# Altium schematic sheet TOP.SchDoc: TOP
size A4; Author: Silvio Navaretti; CompanyName: Arduino SRL; DrawnBy: Silvio Navaretti; Engineer: Silvio Navaretti; Organization: Arduino SRL; DocumentNumber: ASX00083; SheetNumber: 1; SheetTotal: 11; RevAuthor: Silvio Navaretti
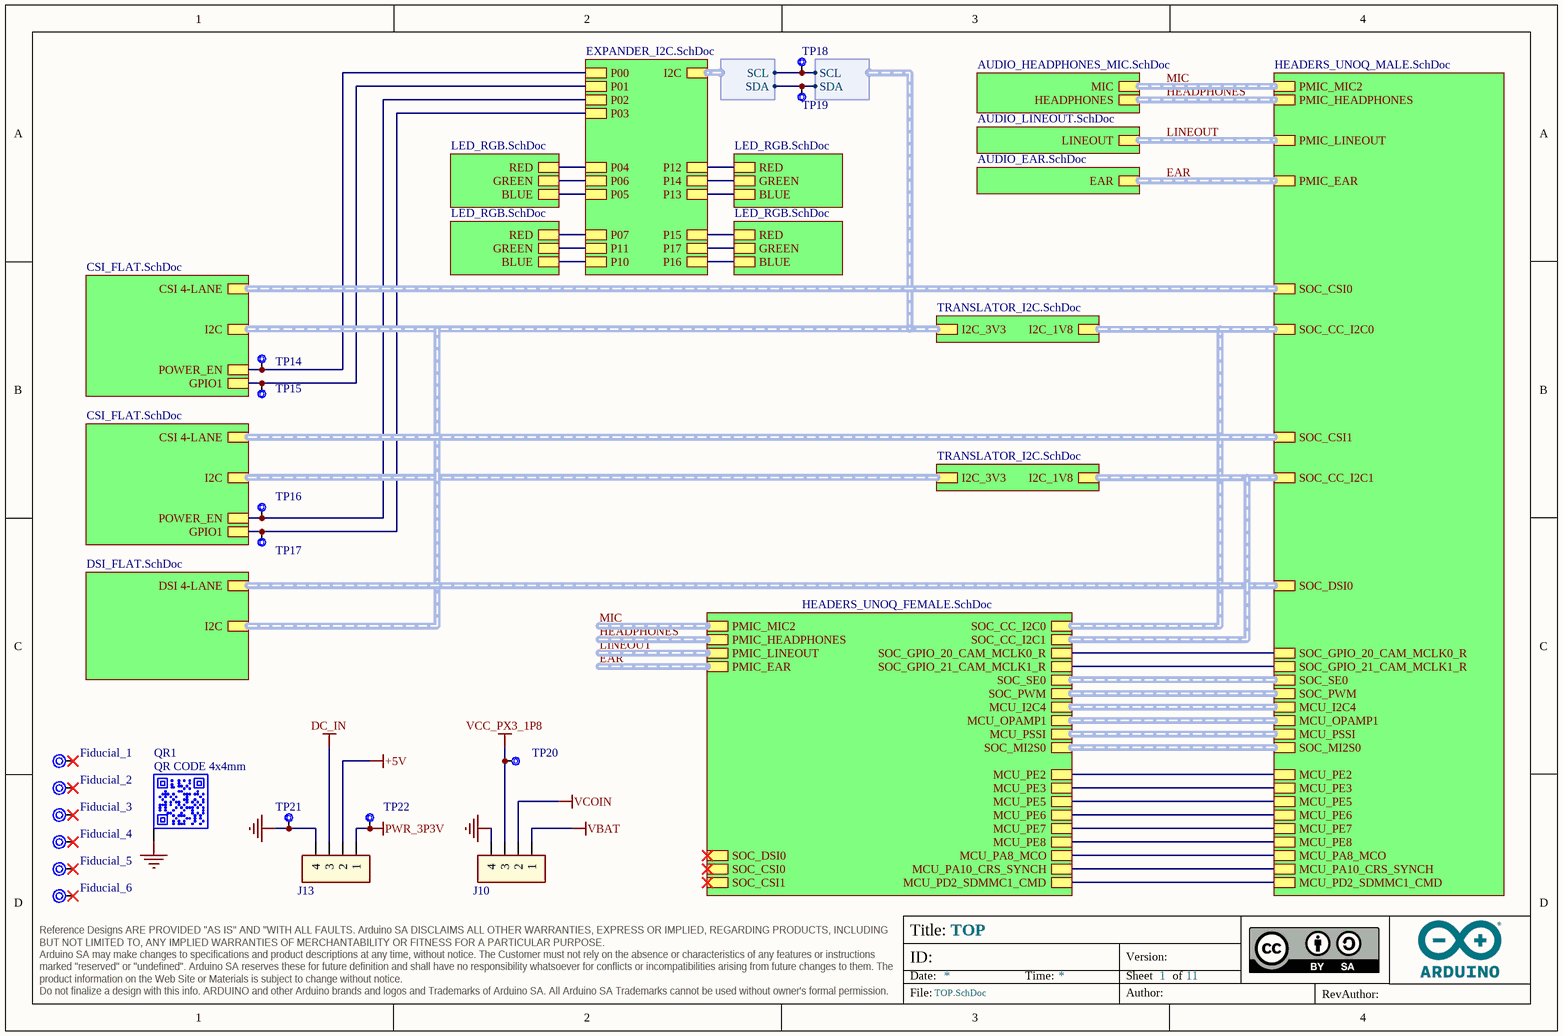
[diagram p0: TOP.SchDoc]

## Parts
Fiducial_1  Fiducial mark 1mm with 2mm solder  [Fiducial mark 1mm with circle-Footprint-1]  (value not drawn)  (no BOM)
Fiducial_2  Fiducial mark 1mm with 2mm solder  [Fiducial mark 1mm with circle-Footprint-1]  (value not drawn)  (no BOM)
Fiducial_3  Fiducial mark 1mm with 2mm solder  [Fiducial mark 1mm with circle-Footprint-1]  (value not drawn)  (no BOM)
Fiducial_4  Fiducial mark 1mm with 2mm solder  [Fiducial mark 1mm with circle-Footprint-1]  (value not drawn)  (no BOM)
Fiducial_5  Fiducial mark 1mm with 2mm solder  [Fiducial mark 1mm with circle-Footprint-1]  (value not drawn)  (no BOM)
Fiducial_6  Fiducial mark 1mm with 2mm solder  [Fiducial mark 1mm with circle-Footprint-1]  (value not drawn)  (no BOM)
J10  HEADER TH 2.54mm VERT. 1x004POS  [PIN HEADER 2.54mm VERT. 1x4POS-Footprint-1]  (value not drawn)  (no BOM)
J13  HEADER TH 2.54mm VERT. 1x004POS  [PIN HEADER 2.54mm VERT. 1x4POS-Footprint-1]  (value not drawn)  (no BOM)
QR1  QR CODE 4x4mm  [QR CODE 4x4mm]  (no BOM)
TP14  Test point 1.00mm  [TP-1.00MM]  (value not drawn)  (no BOM)
TP15  Test point 1.00mm  [TP-1.00MM]  (value not drawn)  (no BOM)
TP16  Test point 1.00mm  [TP-1.00MM]  (value not drawn)  (no BOM)
TP17  Test point 1.00mm  [TP-1.00MM]  (value not drawn)  (no BOM)
TP18  Test point 1.00mm  [TP-1.00MM]  (value not drawn)  (no BOM)
TP19  Test point 1.00mm  [TP-1.00MM]  (value not drawn)  (no BOM)
TP20  Test point 1.00mm  [TP-1.00MM]  (value not drawn)  (no BOM)
TP21  Test point 1.00mm  [TP-1.00MM]  (value not drawn)  (no BOM)
TP22  Test point 1.00mm  [TP-1.00MM]  (value not drawn)  (no BOM)

## Sub-sheets
U_AUDIO_EAR = AUDIO_EAR.SchDoc: EAR (harness EAR)
U_AUDIO_HEADPHONES_MIC = AUDIO_HEADPHONES_MIC.SchDoc: MIC (harness MIC), HEADPHONES (harness HEADPHONES)
U_AUDIO_LINEOUT = AUDIO_LINEOUT.SchDoc: LINEOUT (harness LINEOUT)
U_DSI_FLAT = DSI_FLAT.SchDoc: I2C (harness I2C), DSI 4-LANE (harness SOC_GPIO)
U_FLAT_CSI = CSI_FLAT.SchDoc: I2C (harness I2C), CSI 4-LANE (harness IMOLA_CSI), POWER_EN, GPIO1
U_FLAT_CSI = CSI_FLAT.SchDoc: I2C (harness I2C), CSI 4-LANE (harness IMOLA_CSI), POWER_EN, GPIO1
U_HEADERS_IMOLA_FEMALE = HEADERS_UNOQ_FEMALE.SchDoc: SOC_CSI0 (harness IMOLA_CSI), SOC_GPIO_20_CAM_MCLK0_R, SOC_CC_I2C1 (harness I2C), SOC_CSI1 (harness IMOLA_CSI), SOC_GPIO_21_CAM_MCLK1_R, SOC_CC_I2C0 (harness I2C), SOC_DSI0 (harness IMOLA_DSI), MCU_PSSI (harness PSSI_MCU), PMIC_MIC2 (harness MIC), MCU_PD2_SDMMC1_CMD, MCU_I2C4 (harness I2C), MCU_OPAMP1 (harness MCU_OPAMP), PMIC_LINEOUT (harness LINEOUT), PMIC_HEADPHONES (harness HEADPHONES), SOC_PWM (harness SOC_PWM), SOC_SE0 (harness SOC_GPIO), MCU_PA10_CRS_SYNCH, MCU_PA8_MCO, MCU_PE7, MCU_PE8, PMIC_EAR (harness EAT), SOC_MI2S0 (harness SOC_I2S), MCU_PE2, MCU_PE3, MCU_PE5, MCU_PE6
U_HEADERS_IMOLA_MALE = HEADERS_UNOQ_MALE.SchDoc: SOC_CSI0 (harness IMOLA_CSI), SOC_GPIO_20_CAM_MCLK0_R, SOC_CC_I2C1 (harness I2C), SOC_CSI1 (harness IMOLA_CSI), SOC_GPIO_21_CAM_MCLK1_R, SOC_CC_I2C0 (harness I2C), SOC_DSI0 (harness IMOLA_DSI), MCU_PSSI (harness PSSI_MCU), PMIC_MIC2 (harness MIC), MCU_PD2_SDMMC1_CMD, MCU_I2C4 (harness I2C), MCU_OPAMP1 (harness MCU_OPAMP), PMIC_LINEOUT (harness LINEOUT), PMIC_HEADPHONES (harness HEADPHONES), SOC_PWM (harness SOC_PWM), SOC_SE0 (harness SOC_GPIO), MCU_PA10_CRS_SYNCH, MCU_PA8_MCO, MCU_PE7, MCU_PE8, PMIC_EAR (harness EAT), SOC_MI2S0 (harness SOC_I2S), MCU_PE2, MCU_PE3, MCU_PE5, MCU_PE6
U_LED_RGB_1 = LED_RGB.SchDoc: GREEN, BLUE, RED
U_LED_RGB_2 = LED_RGB.SchDoc: GREEN, BLUE, RED
U_LED_RGB_3 = LED_RGB.SchDoc: GREEN, BLUE, RED
U_LED_RGB_4 = LED_RGB.SchDoc: GREEN, BLUE, RED
U_Sheet1 = EXPANDER_I2C.SchDoc: I2C (harness I2C), P00, P01, P02, P03, P04, P05, P06, P07, P10, P11, P12, P13, P14, P15, P16, P17
U_TRANSLATOR_I2C = TRANSLATOR_I2C.SchDoc: I2C_3V3 (harness I2C), I2C_1V8 (harness I2C)
U_TRANSLATOR_I2C = TRANSLATOR_I2C.SchDoc: I2C_3V3 (harness I2C), I2C_1V8 (harness I2C)

## Harnesses
I2C: SDA, SCL

## Nets
+5V: J13.2
DC_IN: J13.3
GND: J10.4 J13.4 QR1.PAD TP21.X
PWR_3P3V: J13.1 TP22.X
VBAT: J10.1
VCC_PX3_1P8: J10.3 TP20.X
VCOIN: J10.2
NetTP14_X: TP14.X ; sheet U_FLAT_CSI/POWER_EN, sheet U_Sheet1/P00
NetTP15_X: TP15.X ; sheet U_FLAT_CSI/GPIO1, sheet U_Sheet1/P01
NetTP16_X: TP16.X ; sheet U_FLAT_CSI/POWER_EN, sheet U_Sheet1/P02
NetTP17_X: TP17.X ; sheet U_FLAT_CSI/GPIO1, sheet U_Sheet1/P03
NetTP18_X: TP18.X ; sheet U_Sheet1/I2C.SCL, sheet U_FLAT_CSI/I2C.SCL
NetTP19_X: TP19.X ; sheet U_Sheet1/I2C.SDA, sheet U_FLAT_CSI/I2C.SDA
(unnamed): sheet U_HEADERS_IMOLA_MALE/SOC_GPIO_20_CAM_MCLK0_R, sheet U_HEADERS_IMOLA_FEMALE/SOC_GPIO_20_CAM_MCLK0_R
(unnamed): sheet U_HEADERS_IMOLA_MALE/SOC_GPIO_21_CAM_MCLK1_R, sheet U_HEADERS_IMOLA_FEMALE/SOC_GPIO_21_CAM_MCLK1_R
(unnamed): sheet U_HEADERS_IMOLA_MALE/MCU_PD2_SDMMC1_CMD, sheet U_HEADERS_IMOLA_FEMALE/MCU_PD2_SDMMC1_CMD
(unnamed): sheet U_HEADERS_IMOLA_MALE/MCU_PA10_CRS_SYNCH, sheet U_HEADERS_IMOLA_FEMALE/MCU_PA10_CRS_SYNCH
(unnamed): sheet U_HEADERS_IMOLA_MALE/MCU_PA8_MCO, sheet U_HEADERS_IMOLA_FEMALE/MCU_PA8_MCO
(unnamed): sheet U_HEADERS_IMOLA_MALE/MCU_PE7, sheet U_HEADERS_IMOLA_FEMALE/MCU_PE7
(unnamed): sheet U_HEADERS_IMOLA_MALE/MCU_PE8, sheet U_HEADERS_IMOLA_FEMALE/MCU_PE8
(unnamed): sheet U_HEADERS_IMOLA_MALE/MCU_PE2, sheet U_HEADERS_IMOLA_FEMALE/MCU_PE2
(unnamed): sheet U_HEADERS_IMOLA_MALE/MCU_PE3, sheet U_HEADERS_IMOLA_FEMALE/MCU_PE3
(unnamed): sheet U_HEADERS_IMOLA_MALE/MCU_PE5, sheet U_HEADERS_IMOLA_FEMALE/MCU_PE5
(unnamed): sheet U_HEADERS_IMOLA_MALE/MCU_PE6, sheet U_HEADERS_IMOLA_FEMALE/MCU_PE6
(unnamed): sheet U_Sheet1/P04, sheet U_LED_RGB_1/RED
(unnamed): sheet U_Sheet1/P05, sheet U_LED_RGB_1/BLUE
(unnamed): sheet U_Sheet1/P06, sheet U_LED_RGB_1/GREEN
(unnamed): sheet U_Sheet1/P07, sheet U_LED_RGB_2/RED
(unnamed): sheet U_Sheet1/P10, sheet U_LED_RGB_2/BLUE
(unnamed): sheet U_Sheet1/P11, sheet U_LED_RGB_2/GREEN
(unnamed): sheet U_Sheet1/P12, sheet U_LED_RGB_3/RED
(unnamed): sheet U_Sheet1/P13, sheet U_LED_RGB_3/BLUE
(unnamed): sheet U_Sheet1/P14, sheet U_LED_RGB_3/GREEN
(unnamed): sheet U_Sheet1/P15, sheet U_LED_RGB_4/RED
(unnamed): sheet U_Sheet1/P16, sheet U_LED_RGB_4/BLUE
(unnamed): sheet U_Sheet1/P17, sheet U_LED_RGB_4/GREEN

Not connected (* = marked no-connect by the designer): Fiducial_1 1*; Fiducial_2 1*; Fiducial_3 1*; Fiducial_4 1*; Fiducial_5 1*; Fiducial_6 1*

## Buses and harness runs
harness EAR = sheet U_AUDIO_EAR/EAR = sheet U_HEADERS_IMOLA_MALE/PMIC_EAR
harness EAR = sheet U_HEADERS_IMOLA_FEMALE/PMIC_EAR
harness HEADPHONES = sheet U_AUDIO_HEADPHONES_MIC/HEADPHONES = sheet U_HEADERS_IMOLA_MALE/PMIC_HEADPHONES
harness HEADPHONES = sheet U_HEADERS_IMOLA_FEMALE/PMIC_HEADPHONES
harness LINEOUT = sheet U_AUDIO_LINEOUT/LINEOUT = sheet U_HEADERS_IMOLA_MALE/PMIC_LINEOUT
harness LINEOUT = sheet U_HEADERS_IMOLA_FEMALE/PMIC_LINEOUT
harness MIC = sheet U_AUDIO_HEADPHONES_MIC/MIC = sheet U_HEADERS_IMOLA_MALE/PMIC_MIC2
harness MIC = sheet U_HEADERS_IMOLA_FEMALE/PMIC_MIC2
harness sheet U_DSI_FLAT/DSI 4-LANE = sheet U_HEADERS_IMOLA_MALE/SOC_DSI0
harness sheet U_DSI_FLAT/I2C = sheet U_FLAT_CSI/I2C = sheet U_TRANSLATOR_I2C/I2C_3V3
harness sheet U_FLAT_CSI/CSI 4-LANE = sheet U_HEADERS_IMOLA_MALE/SOC_CSI0
harness sheet U_FLAT_CSI/CSI 4-LANE = sheet U_HEADERS_IMOLA_MALE/SOC_CSI1
harness sheet U_FLAT_CSI/I2C = sheet U_TRANSLATOR_I2C/I2C_3V3
harness sheet U_HEADERS_IMOLA_FEMALE/MCU_I2C4 = sheet U_HEADERS_IMOLA_MALE/MCU_I2C4
harness sheet U_HEADERS_IMOLA_FEMALE/MCU_OPAMP1 = sheet U_HEADERS_IMOLA_MALE/MCU_OPAMP1
harness sheet U_HEADERS_IMOLA_FEMALE/MCU_PSSI = sheet U_HEADERS_IMOLA_MALE/MCU_PSSI
harness sheet U_HEADERS_IMOLA_FEMALE/SOC_CC_I2C0 = sheet U_HEADERS_IMOLA_MALE/SOC_CC_I2C0 = sheet U_TRANSLATOR_I2C/I2C_1V8
harness sheet U_HEADERS_IMOLA_FEMALE/SOC_CC_I2C1 = sheet U_HEADERS_IMOLA_MALE/SOC_CC_I2C1 = sheet U_TRANSLATOR_I2C/I2C_1V8
harness sheet U_HEADERS_IMOLA_FEMALE/SOC_MI2S0 = sheet U_HEADERS_IMOLA_MALE/SOC_MI2S0
harness sheet U_HEADERS_IMOLA_FEMALE/SOC_PWM = sheet U_HEADERS_IMOLA_MALE/SOC_PWM
harness sheet U_HEADERS_IMOLA_FEMALE/SOC_SE0 = sheet U_HEADERS_IMOLA_MALE/SOC_SE0

## Notes on the sheet
- Title:
- ID:
- Date:
- Time:
- Version:
- Sheet
- of
- RevAuthor:
- Reference Designs ARE PROVIDED "AS IS" AND "WITH ALL FAULTS. Arduino SA DISCLAIMS ALL OTHER WARRANTIES, EXPRESS OR IMPLIED, REGARDING PRODUCTS, INCLUDING BUT NOT LIMITED TO, ANY IMPLIED WARRANTIES OF MERCHANTABILITY OR FITNESS FOR A PARTICULAR PURPOSE.
  Arduino SA may make changes to specifications and product descriptions at any time, without notice. The Customer must not rely on the absence or characteristics of any features or instructions marked "reserved" or "undefined". Arduino SA reserves these for future definition and shall have no responsibility whatsoever for conflicts or incompatibilities arising from future changes to them. The product information on the Web Site or Materials is subject to change without notice.
  Do not finalize a design with this info. ARDUINO and other Arduino brands and logos and Trademarks of Arduino SA. All Arduino SA Trademarks cannot be used without owner's formal permission.
- File:
- Author:

## Library data of the parts
Fiducial_1-Fiducial_6 = UT0024-A.6
J10 J13 = J0162-A.6: Code Arduino: J0162
QR1 = QR-0001-A.5: QR CODE 4x4mm on layer 34 (This is not a component); Code Arduino: QRCODE_4x4mm; Part Number: This is not a component; Manufacturer: This is not a component
TP14-TP22 = UT0013-A.6: Manufacturer: This is not a component; Source: ut.SchLib; Pin Count: 1; Design Item ID: CMP-018-0005-A.3; Part Number: This is not a component; Code Arduino: This is not a component